# EAGLE design NES Board Connector (EAGLE 8.3.0)
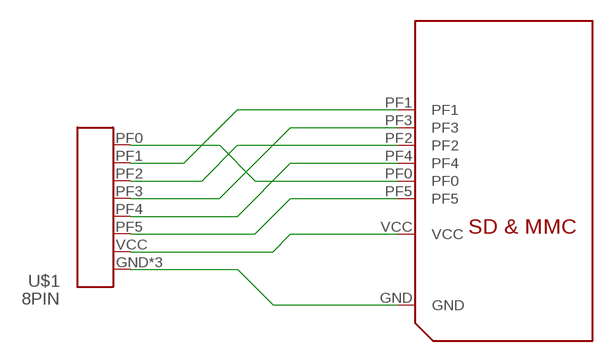
[diagram p0: schematic, sheet 1]

## Parts
U$1  8PIN  [SFV8R-3STBE1HLF]
U$2  NES-MOTHERBOARD-HEADER  [NES-MOTHERBOARD-HEADER]

## Nets
GND: U$1.GND U$1.GNDP1(GND) U$1.GNDP2(GND) U$2.GND
PF0: U$1.PF0 U$2.PF0
PF1: U$1.PF1 U$2.PF1
PF2: U$1.PF2 U$2.PF2
PF3: U$1.PF3 U$2.PF3
PF4: U$1.PF4 U$2.PF4
PF5: U$1.PF5 U$2.PF5
VCC: U$1.VCC U$2.VCC

## Library data of the parts
U$1 = nintendo-classic:8PIN
U$2 = nintendo-classic:NES-MOTHERBOARD-HEADER

## Board
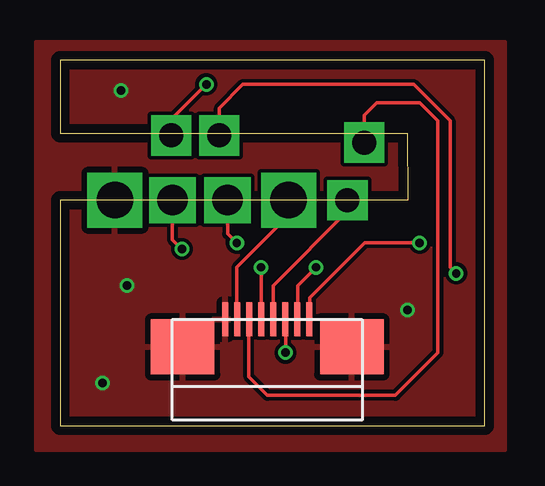
[diagram p1: board, top side]
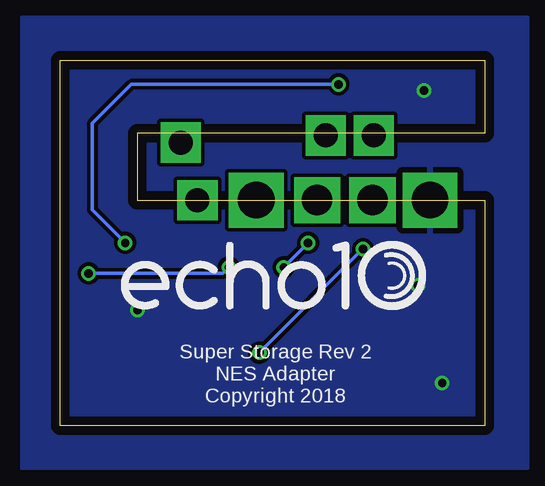
[diagram p2: board, bottom side, seen from below]

Size 17.7 x 15.24 mm. Coordinates in mm from the lower left corner, seen from the top.
Outline: 0,0 17.7,0 17.7,15.23 0,15.24 0,12.19 14.48,12.19 14.49,9.39 0,9.39 0,0
Copper layers (1*16): Top 0.035559375mm / dielectric 1.6mm / Bottom 0.035559375mm
Design rules "oshpark-2layer": minimum track width 6mil, minimum drill 10mil, track to track 6mil, track to pad 6mil, pad to pad 6mil, via to via 6mil, smd to smd 6mil, copper to edge 15mil, drill to drill 6mil, minimum pad ring 5mil, minimum via ring 5mil, stop-mask expansion 2.5mil, vias tented up to drill 0mil, thermal gap 10mil

### Footprints (pad centres in the part's own frame; a part is rotated, then mirrored left to right if it is on the bottom)
SFV8R-3STBE1HLF = smd 0.25 x 1.4: GND -1.75,2.15; PF0 1.75,2.15; PF1 1.25,2.15; PF2 0.75,2.15; PF3 0.25,2.15; PF4 -0.25,2.15; PF5 -0.75,2.15; VCC -1.25,2.15 | smd 2.65 x 2.3: GNDP1 -3.525,1; GNDP2 3.525,1
NES-MOTHERBOARD-HEADER = drill 1.524 pad 2.1 square: GND 0,0; VCC 7.24,0 | drill 1 pad 1.676 square: PF0 2.35,2.7; PF1 4.35,2.7; PF3 9.69,0; PF5 10.39,2.4 | drill 1.27 pad 1.93 square: PF2 2.4,0; PF4 4.7,0

### Placement (x,y rotation side)
U$1  8.64,2.29 0 top
U$2  2.29,9.4 0 top

### Tracks (layer width: path | path; a pad name or v marks a point on that pad's centre or on a via)
GND  (via drill 0.35)
  other vias: 14.48,4.83 2.54,13.97 2.79,5.84 1.78,1.78
  pour Top: -1.02,16 -1.02,-1.02 18.54,-1.02 18.54,16
  pour Bottom: -1.78,17.02 -1.78,-1.78 19.3,-1.78 19.3,17.02
PF0  (via drill 0.35)
  Top 0.152: v14.99,7.62 12.7,7.62 10.41,5.33 10.41,4.46 U$1.PF0 | U$2.PF0 4.64,12.76 v6.1,14.22
  Bottom 0.152: v14.99,7.62 16.36,8.99 16.36,12.6 14.73,14.22 v6.1,14.22
PF1  (via drill 0.35)
  Top 0.152: U$2.PF1 6.64,13.24 7.62,14.22 14.73,14.22 16.26,12.7 16.26,6.6 v16.51,6.35 | v10.67,6.6 9.91,5.84 9.91,4.46 U$1.PF1
  Bottom 0.152: v16.51,6.35 10.92,6.35 v10.67,6.6
PF2  (via drill 0.35)
  Top 0.152: v9.4,3.05 9.4,4.42 U$1.PF2 | U$2.PF2 4.69,7.76 v5.08,7.37
  Bottom 0.152: v5.08,7.37 v9.4,3.05
PF3
  Top 0.152: U$2.PF3 11.98,8.93 8.89,5.84 U$1.PF3
PF4  (via drill 0.35)
  Top 0.152: v8.38,6.6 U$1.PF4 | U$2.PF4 6.99,8 v7.37,7.62
  Bottom 0.152: v7.37,7.62 v8.38,6.6
PF5
  Top 0.152: U$2.PF5 12.68,12.93 13.21,13.46 14.99,13.46 15.75,12.7 15.75,3.05 13.97,1.27 8.64,1.27 7.87,2.03 7.87,4.42 U$1.PF5
VCC
  Top 0.152: U$2.VCC 9.53,8.76 7.37,6.6 7.37,4.46 U$1.VCC

### Text on the board
bPlace: Super Storage Rev 2 / NES Adapter / Copyright 2018